# Altium project Animated Archer.PrjPCB (part 2 of 2)
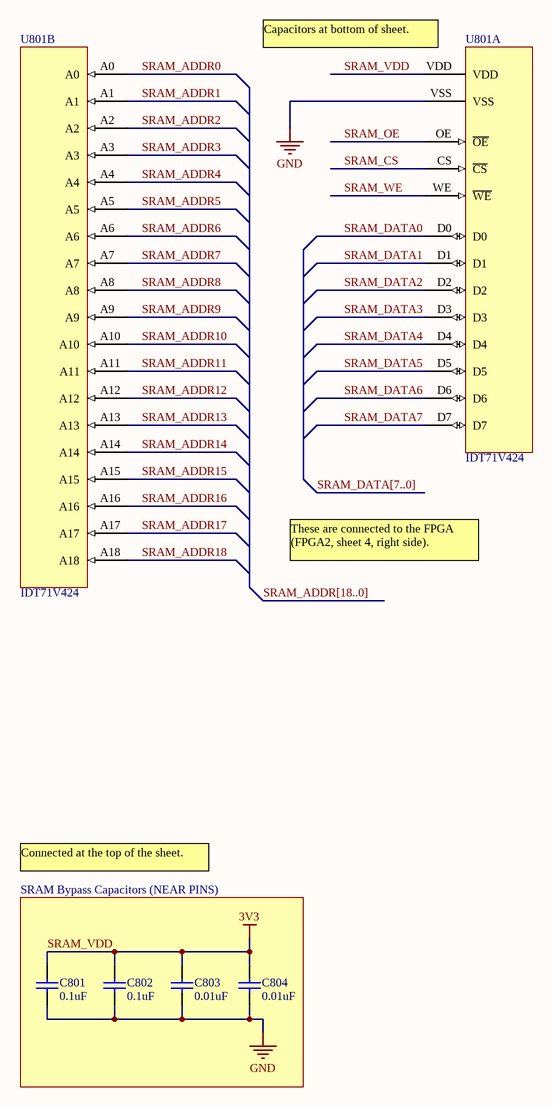
[diagram p8: SRAM.SchDoc]

## Nets that join several sheets
5V: ARM (C5.2 U1.8), POWER (5 pins)
CPLD_VCCIN: JTAG1 (25 pins), JTAG2 (C801#1.2 C802#1.2 U801#1.7 U801#1.35), POWER (C704.2 R701.1 TP701.1 U701.3)
CPLD_VCORE: JTAG1 (C501#2.2 U501.49), JTAG2 (C804#1.2 U801#1.15)
CPLD_VTARGET: ARM (20 pins), FPGA1 (6 pins), FPGA2 (P401.1 P402.1), FPGA3 (52 pins), JTAG1 (C515#2.2), JTAG2 (7 pins), POWER (C706.2 R702.1 TP702.1 U702.3), SRAM (5 pins)
FPGA_SUSPEND: ARM (19 pins), FPGA1 (6 pins), FPGA2 (5 pins), FPGA3 (54 pins), JTAG1 (29 pins), JTAG2 (10 pins), POWER (19 pins), SRAM (5 pins)
FPGA_VCCINT: FPGA3 (15 pins), POWER (C708.2 TP703.1 U703.3)
ARM_JTAG_TCK: ARM (U1.22), JTAG2 (P804.2)
ARM_JTAG_TDI: ARM (U1.23), JTAG2 (P804.6)
ARM_JTAG_TMS: ARM (U1.25), JTAG2 (P804.4)
ARM_MISO: ARM (J101.7 P202.2 R104.2 U1.52), FPGA2 (U301.L4)
ARM_MOSI: ARM (J101.2 P202.3 U1.51), FPGA2 (U301.L5)
ARM_NPCS1: ARM (U1.46), FPGA2 (U301.E1)
ARM_PROG_RESET: ARM (R201.2 U1.60), FPGA2 (U301.K6)
ARM_PROG_TCK: ARM (U1.42), JTAG2 (P802.1)
ARM_PROG_TDI: ARM (U1.40), JTAG2 (P802.5)
ARM_PROG_TMS: ARM (U1.41), JTAG2 (P802.3)
ARM_RESET_N: ARM (U1.34), FPGA2 (U301.K5), JTAG2 (P804.8)
ARM_SCLK: ARM (J101.5 P202.4 U1.50), FPGA2 (U301.E2)
FPGA_JTAG_TCK: FPGA3 (R503#1.1 U301.C14), JTAG2 (P802.2 P805.2)
FPGA_JTAG_TDI: FPGA3 (R502#1.1 U301.C12), JTAG2 (P802.6 P805.6)
FPGA_JTAG_TMS: FPGA3 (R501#1.1 U301.A15), JTAG2 (P802.4 P805.4)
FTDI_AC0: JTAG1 (U501.26), JTAG2 (U801#1.43)
FTDI_AC1: JTAG1 (U501.27), JTAG2 (U801#1.44)
FTDI_AC2: JTAG1 (U501.28), JTAG2 (U801#1.2)
FTDI_AC3: JTAG1 (U501.29), JTAG2 (U801#1.3)
FTDI_AC4: JTAG1 (U501.30), JTAG2 (U801#1.5)
FTDI_AC5: JTAG1 (U501.32), JTAG2 (U801#1.1)
FTDI_AC6: JTAG1 (U501.33), JTAG2 (U801#1.6)
FTDI_AC7: JTAG1 (U501.34), JTAG2 (U801#1.8)
FTDI_AD0: JTAG1 (U501.16), JTAG2 (U801#1.12)
FTDI_AD1: JTAG1 (U501.17), JTAG2 (U801#1.13)
FTDI_AD2: JTAG1 (U501.18), JTAG2 (U801#1.14)
FTDI_AD3: JTAG1 (U501.19), JTAG2 (U801#1.16)
FTDI_AD4: JTAG1 (U501.21), JTAG2 (U801#1.39)
FTDI_AD5: JTAG1 (U501.22), JTAG2 (U801#1.40)
FTDI_AD6: JTAG1 (U501.23), JTAG2 (U801#1.41)
FTDI_AD7: JTAG1 (U501.24), JTAG2 (U801#1.42)
SRAM_ADDR0: FPGA2 (U301.M4), SRAM (U801#2.A0)
SRAM_ADDR1: FPGA2 (U301.M3), SRAM (U801#2.A1)
SRAM_ADDR2: FPGA2 (U301.M5), SRAM (U801#2.A2)
SRAM_ADDR3: FPGA2 (U301.N4), SRAM (U801#2.A3)
SRAM_ADDR4: FPGA2 (U301.R2), SRAM (U801#2.A4)
SRAM_ADDR5: FPGA2 (U301.R1), SRAM (U801#2.A5)
SRAM_ADDR6: FPGA2 (U301.P2), SRAM (U801#2.A6)
SRAM_ADDR7: FPGA2 (U301.P1), SRAM (U801#2.A7)
SRAM_ADDR8: FPGA2 (U301.N3), SRAM (U801#2.A8)
SRAM_ADDR9: FPGA2 (U301.N1), SRAM (U801#2.A9)
SRAM_ADDR10: FPGA2 (U301.M2), SRAM (U801#2.A10)
SRAM_ADDR11: FPGA2 (U301.M1), SRAM (U801#2.A11)
SRAM_ADDR12: FPGA2 (U301.L3), SRAM (U801#2.A12)
SRAM_ADDR13: FPGA2 (U301.L1), SRAM (U801#2.A13)
SRAM_ADDR14: FPGA2 (U301.K2), SRAM (U801#2.A14)
SRAM_ADDR15: FPGA2 (U301.K1), SRAM (U801#2.A15)
SRAM_ADDR16: FPGA2 (U301.J3), SRAM (U801#2.A16)
SRAM_ADDR17: FPGA2 (U301.J1), SRAM (U801#2.A17)
SRAM_ADDR18: FPGA2 (U301.H2), SRAM (U801#2.A18)
SRAM_CS: FPGA2 (U301.G3), SRAM (U801#2.CS)
SRAM_DATA0: FPGA2 (U301.F2), SRAM (U801#2.D0)
SRAM_DATA1: FPGA2 (U301.F1), SRAM (U801#2.D1)
SRAM_DATA2: FPGA2 (U301.K3), SRAM (U801#2.D2)
SRAM_DATA3: FPGA2 (U301.J4), SRAM (U801#2.D3)
SRAM_DATA4: FPGA2 (U301.J6), SRAM (U801#2.D4)
SRAM_DATA5: FPGA2 (U301.H5), SRAM (U801#2.D5)
SRAM_DATA6: FPGA2 (U301.H4), SRAM (U801#2.D6)
SRAM_DATA7: FPGA2 (U301.H3), SRAM (U801#2.D7)
SRAM_OE: FPGA2 (U301.H1), SRAM (U801#2.OE)
SRAM_WE: FPGA2 (U301.G1), SRAM (U801#2.WE)
USB_DM: JTAG1 (U501.7), POWER (J701.2)
USB_DP: JTAG1 (U501.8), POWER (J701.3)